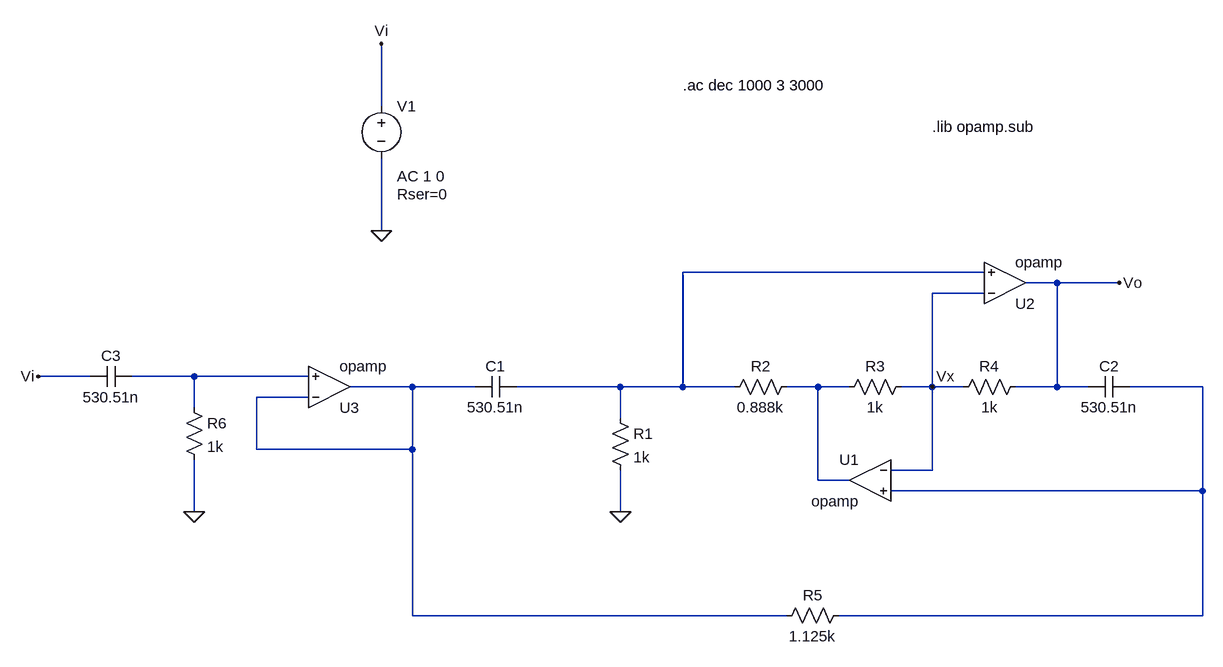
[diagram p0: schematic Circuit2.asc]
Circuit2.asc, the LTspice schematic file:
Version 4
SHEET 1 880 680
WIRE -480 -272 -480 -368
WIRE -480 -80 -480 -192
WIRE 448 -16 -16 -16
WIRE 560 0 512 0
WIRE 656 0 560 0
WIRE 448 16 368 16
WIRE -928 144 -1008 144
WIRE -768 144 -864 144
WIRE -592 144 -768 144
WIRE -432 160 -528 160
WIRE -336 160 -432 160
WIRE -112 160 -272 160
WIRE -16 160 -16 -16
WIRE -16 160 -112 160
WIRE 64 160 -16 160
WIRE 192 160 144 160
WIRE 240 160 192 160
WIRE 368 160 368 16
WIRE 368 160 320 160
WIRE 416 160 368 160
WIRE 560 160 560 0
WIRE 560 160 496 160
WIRE 608 160 560 160
WIRE 784 160 672 160
WIRE -592 176 -672 176
WIRE -768 192 -768 144
WIRE -112 208 -112 160
WIRE -672 256 -672 176
WIRE -432 256 -432 160
WIRE -432 256 -672 256
WIRE 368 288 368 160
WIRE 368 288 304 288
WIRE 192 304 192 160
WIRE 240 304 192 304
WIRE 784 320 784 160
WIRE 784 320 304 320
WIRE -768 352 -768 272
WIRE -112 352 -112 288
WIRE -432 512 -432 256
WIRE 144 512 -432 512
WIRE 784 512 784 320
WIRE 784 512 224 512
FLAG -112 352 0
FLAG 656 0 Vo
FLAG -480 -368 Vi
FLAG -480 -80 0
FLAG 368 160 Vx
FLAG -1008 144 Vi
FLAG -768 352 0
SYMBOL res -128 192 R0
SYMATTR InstName R1
SYMATTR Value 1k
SYMBOL res 160 144 R90
WINDOW 0 0 56 VBottom 2
WINDOW 3 32 56 VTop 2
SYMATTR InstName R2
SYMATTR Value 0.888k
SYMBOL res 336 144 R90
WINDOW 0 0 56 VBottom 2
WINDOW 3 32 56 VTop 2
SYMATTR InstName R3
SYMATTR Value 1k
SYMBOL res 512 144 R90
WINDOW 0 0 56 VBottom 2
WINDOW 3 32 56 VTop 2
SYMATTR InstName R4
SYMATTR Value 1k
SYMBOL res 240 496 R90
WINDOW 0 0 56 VBottom 2
WINDOW 3 32 56 VTop 2
SYMATTR InstName R5
SYMATTR Value 1.125k
SYMBOL cap -272 144 R90
WINDOW 0 0 32 VBottom 2
WINDOW 3 32 32 VTop 2
SYMATTR InstName C1
SYMATTR Value 530.51n
SYMATTR SpiceLine Rser=0
SYMBOL cap 672 144 R90
WINDOW 0 0 32 VBottom 2
WINDOW 3 32 32 VTop 2
SYMATTR InstName C2
SYMATTR Value 530.51n
SYMATTR SpiceLine Rser=0
SYMBOL OpAmps\\opamp 272 240 M0
SYMATTR InstName U1
SYMBOL OpAmps\\opamp 480 64 M180
SYMATTR InstName U2
SYMBOL voltage -480 -288 R0
WINDOW 123 24 124 Left 2
WINDOW 39 24 152 Left 2
SYMATTR Value2 AC 1 0
SYMATTR SpiceLine Rser=0
SYMATTR InstName V1
SYMATTR Value ""
SYMBOL OpAmps\\opamp -560 224 M180
SYMATTR InstName U3
SYMBOL cap -864 128 R90
WINDOW 0 0 32 VBottom 2
WINDOW 3 32 32 VTop 2
SYMATTR InstName C3
SYMATTR Value 530.51n
SYMATTR SpiceLine Rser=0
SYMBOL res -784 176 R0
SYMATTR InstName R6
SYMATTR Value 1k
TEXT 368 -240 Left 2 !.lib opamp.sub
TEXT -16 -304 Left 2 !.ac dec 1000 3 3000

The netlist it stands for:
* Circuit2.asc
R1 N001 0 1k
R2 N004 N001 0.888k
R3 Vx N004 1k
R4 Vo Vx 1k
R5 N005 N003 1.125k
C1 N001 N003 530.51n Rser=0
C2 N005 Vo 530.51n Rser=0
XU1 Vx N005 N004 opamp Aol=100K GBW=10Meg  ; pins invin noninvin out
XU2 Vx N001 Vo opamp Aol=100K GBW=10Meg  ; pins invin noninvin out
V1 Vi 0 AC 1 0 Rser=0
XU3 N003 N002 N003 opamp Aol=100K GBW=10Meg  ; pins invin noninvin out
C3 N002 Vi 530.51n Rser=0
R6 N002 0 1k
.lib opamp.sub
.ac dec 1000 3 3000
.backanno
.end

* Results of the author's LTspice run, read from the files saved beside the schematic
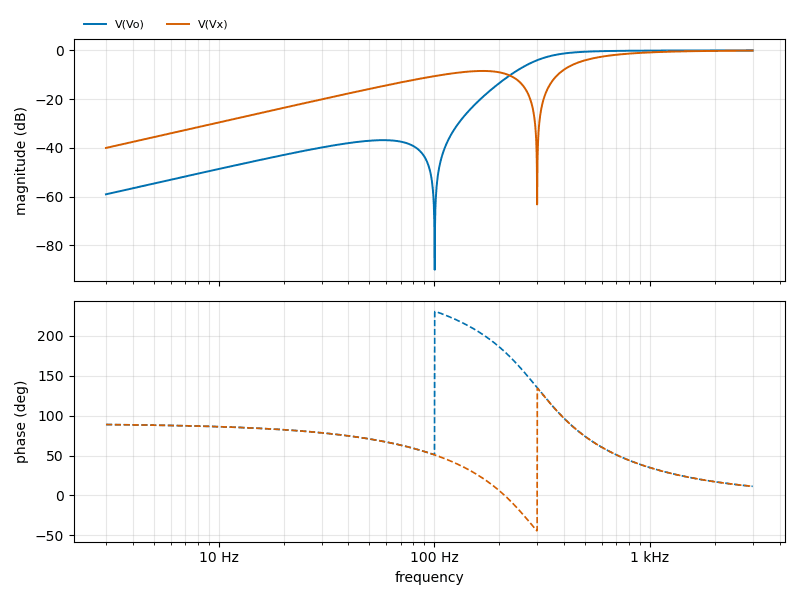
[diagram p1: AC Analysis of Circuit2.asc, plotted from the saved traces]
* AC Analysis, 1 run:
*   V(Vo): -59.02 dB at 3 Hz, -0.01 dB at 3 kHz, peak -0.01 dB at 3 kHz, 3 dB below the peak at 323.4 Hz
*   V(Vx): -40.00 dB at 3 Hz, -0.09 dB at 3 kHz, peak -0.09 dB at 3 kHz, 3 dB below the peak at 555.9 Hz